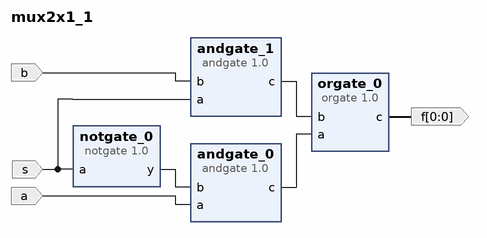
[diagram p0: block diagram of the top level]
# Vivado block design mux2x1_1, xc7a35tcpg236-1, Vivado 2018.3
create_bd_design mux2x1_1

create_bd_port -dir I s
create_bd_port -dir I b
create_bd_port -dir O -from 0 -to 0 f
create_bd_port -dir I a

create_bd_cell -type ip -vlnv xilinx.com:user:andgate:1.0 andgate_0
create_bd_cell -type ip -vlnv xilinx.com:user:andgate:1.0 andgate_1
create_bd_cell -type ip -vlnv xilinx.com:user:orgate:1.0 orgate_0
create_bd_cell -type ip -vlnv xilinx.com:user:notgate:1.0 notgate_0

# ---- connections ----

connect_bd_net [get_bd_ports s] [get_bd_pins notgate_0/a] [get_bd_pins andgate_1/a]
connect_bd_net [get_bd_ports b] [get_bd_pins andgate_1/b]
connect_bd_net [get_bd_pins andgate_1/c] [get_bd_pins orgate_0/b]
connect_bd_net [get_bd_pins andgate_0/c] [get_bd_pins orgate_0/a]
connect_bd_net [get_bd_pins notgate_0/y] [get_bd_pins andgate_0/b]
connect_bd_net [get_bd_pins orgate_0/c] [get_bd_ports f]
connect_bd_net [get_bd_ports a] [get_bd_pins andgate_0/a]

validate_bd_design
save_bd_design
